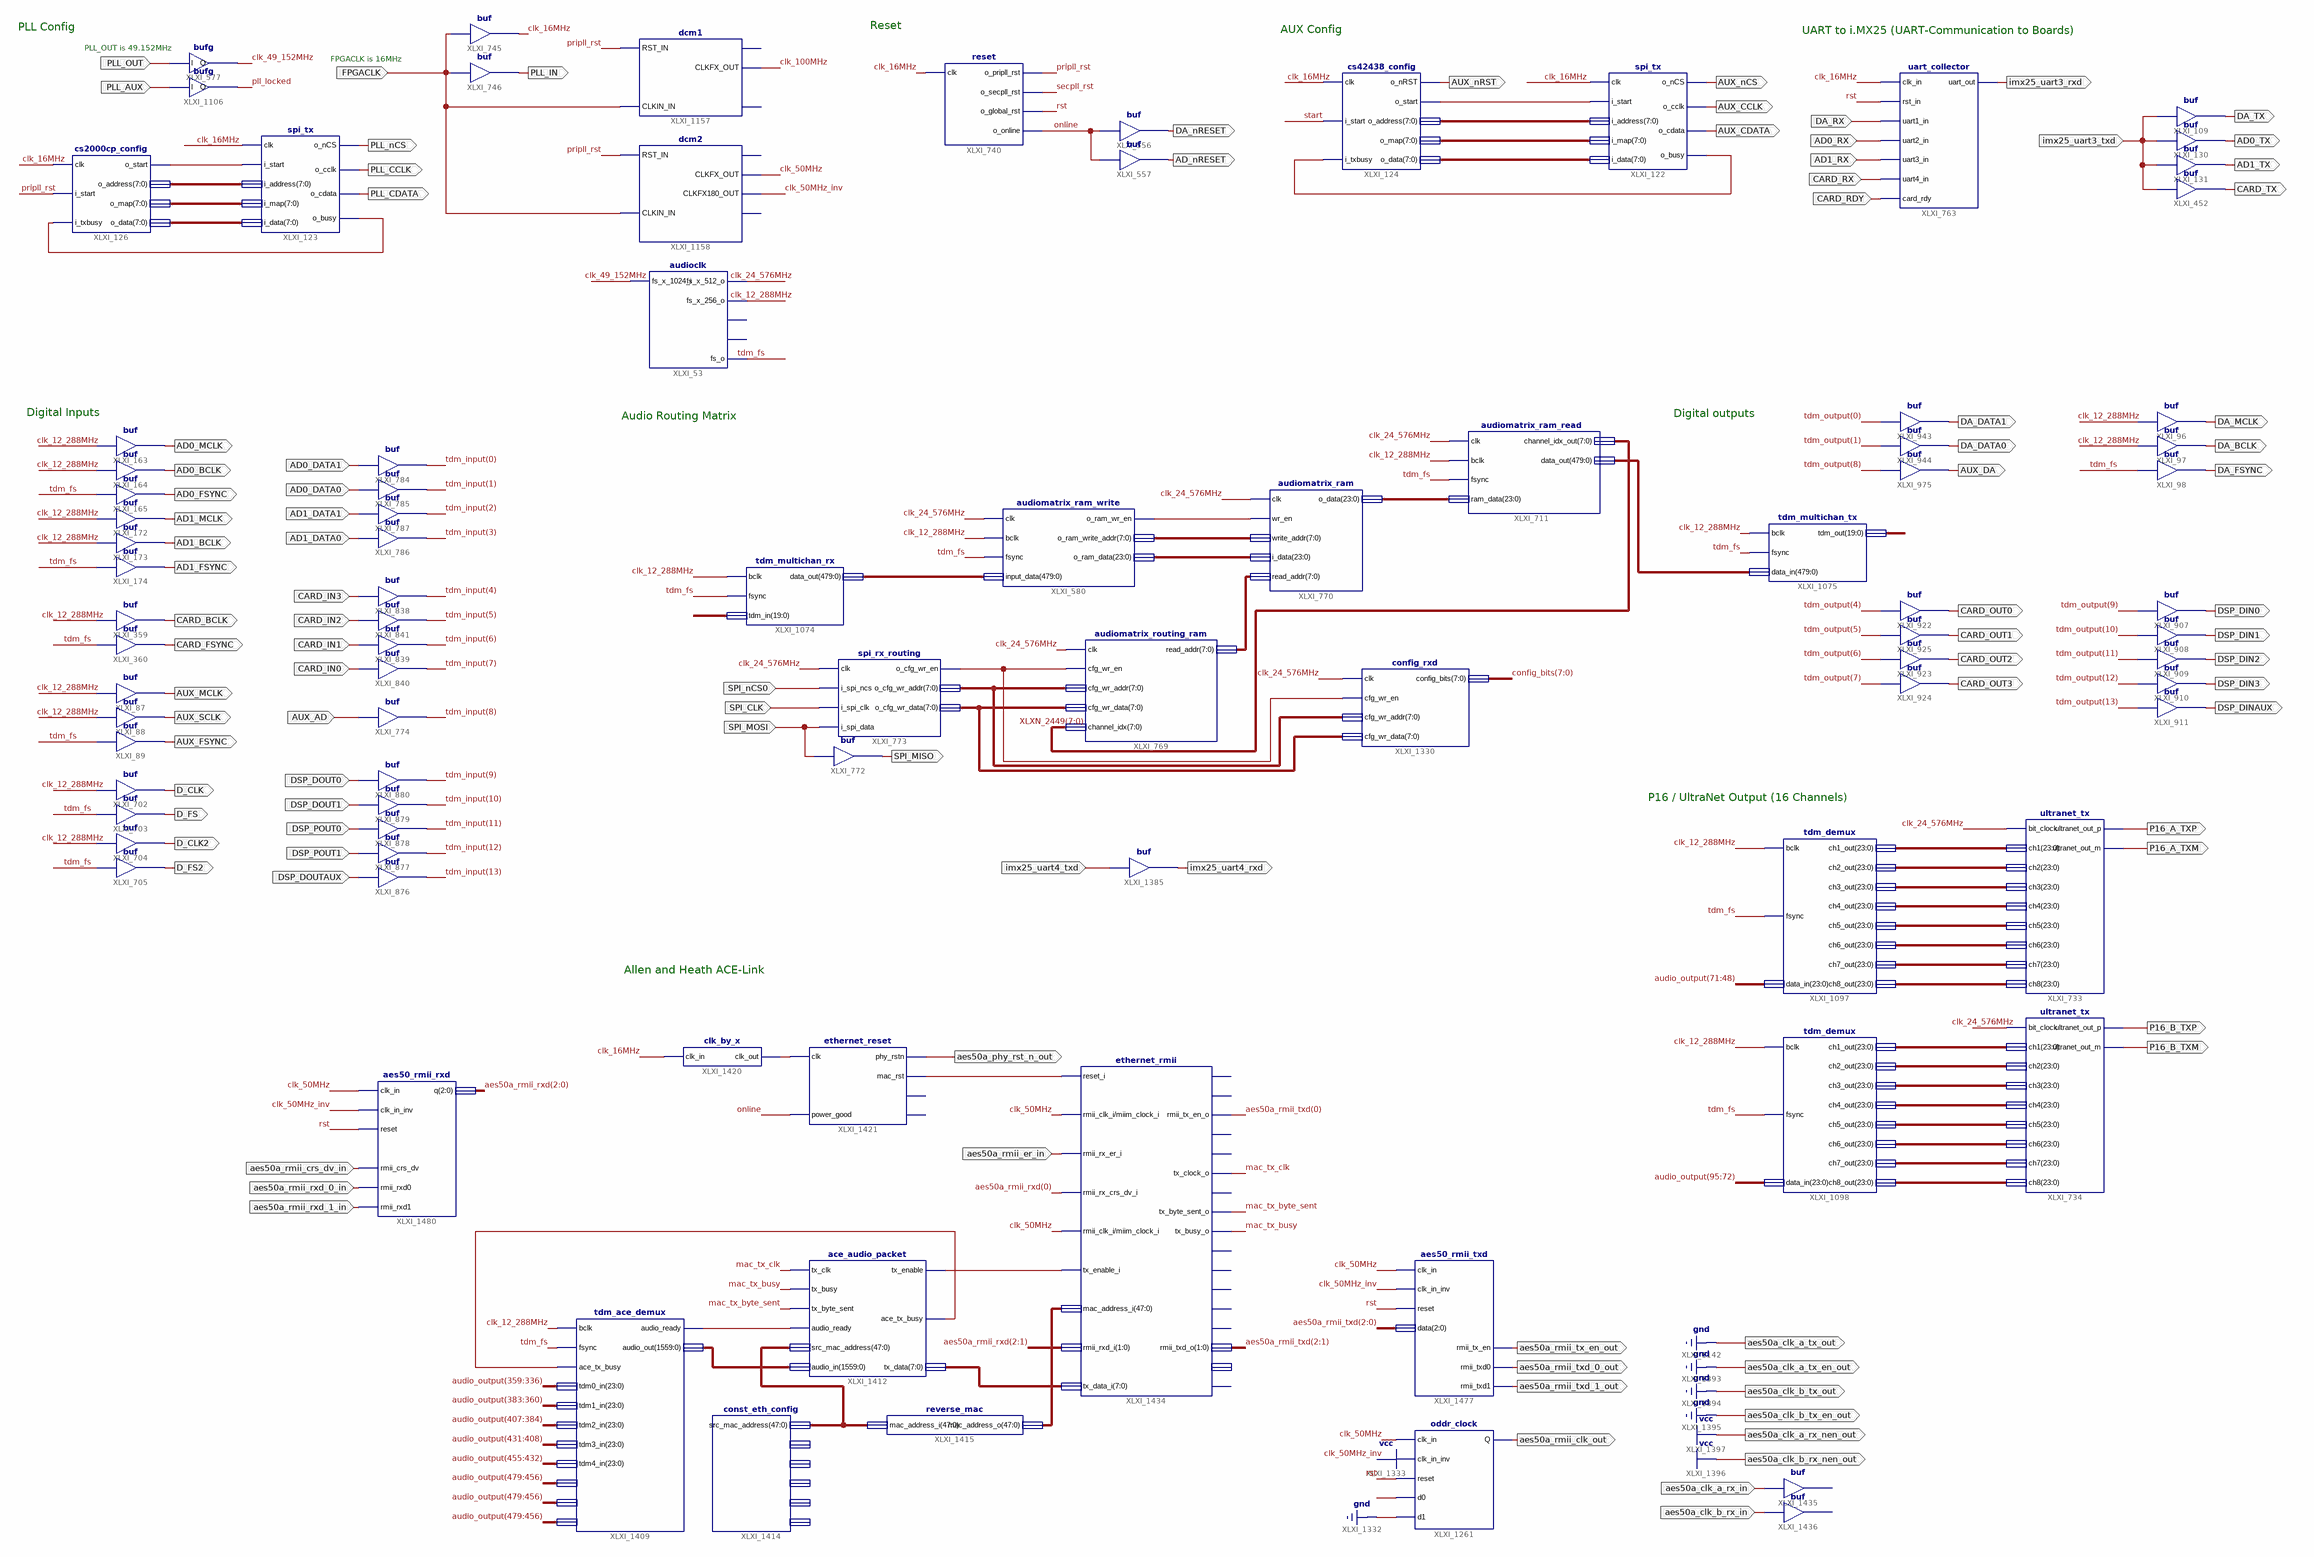
[diagram p0: schematic sheet 1]
// Xilinx ISE schematic main_withACEaudio.sch (spartan3a) as structural Verilog: 89 symbols, 95 ports
module main_withACEaudio (
  input  AD0_DATA1,
  input  AD0_DATA0,
  input  AD1_DATA1,
  input  AD1_DATA0,
  input  CARD_IN3,
  input  CARD_IN2,
  input  CARD_IN1,
  input  CARD_IN0,
  input  AUX_AD,
  input  DSP_DOUT0,
  input  DSP_DOUT1,
  input  DSP_POUT0,
  input  DSP_POUT1,
  input  DSP_DOUTAUX,
  input  SPI_MOSI,
  input  SPI_CLK,
  input  SPI_nCS0,
  input  FPGACLK,
  input  PLL_OUT,
  input  PLL_AUX,
  input  imx25_uart3_txd,
  input  CARD_RX,
  input  AD1_RX,
  input  AD0_RX,
  input  DA_RX,
  input  CARD_RDY,
  input  aes50a_rmii_er_in,
  input  imx25_uart4_txd,
  input  aes50a_clk_a_rx_in,
  input  aes50a_clk_b_rx_in,
  input  aes50a_rmii_crs_dv_in,
  input  aes50a_rmii_rxd_0_in,
  input  aes50a_rmii_rxd_1_in,
  output AD1_MCLK,
  output AD1_BCLK,
  output AD1_FSYNC,
  output AD0_MCLK,
  output AD0_BCLK,
  output AD0_FSYNC,
  output CARD_BCLK,
  output CARD_FSYNC,
  output AUX_MCLK,
  output AUX_SCLK,
  output AUX_FSYNC,
  output D_CLK2,
  output D_FS2,
  output D_CLK,
  output D_FS,
  output P16_A_TXP,
  output P16_A_TXM,
  output P16_B_TXP,
  output P16_B_TXM,
  output SPI_MISO,
  output DSP_DIN0,
  output DSP_DIN1,
  output DSP_DIN2,
  output DSP_DIN3,
  output DSP_DINAUX,
  output CARD_OUT0,
  output CARD_OUT1,
  output CARD_OUT2,
  output CARD_OUT3,
  output DA_MCLK,
  output DA_BCLK,
  output DA_FSYNC,
  output DA_DATA0,
  output DA_DATA1,
  output AUX_DA,
  output PLL_nCS,
  output PLL_CDATA,
  output PLL_CCLK,
  output PLL_IN,
  output DA_TX,
  output AD0_TX,
  output AD1_TX,
  output CARD_TX,
  output imx25_uart3_rxd,
  output AUX_nRST,
  output AUX_nCS,
  output AUX_CCLK,
  output AUX_CDATA,
  output DA_nRESET,
  output AD_nRESET,
  output aes50a_phy_rst_n_out,
  output imx25_uart4_rxd,
  output aes50a_clk_b_rx_nen_out,
  output aes50a_clk_a_rx_nen_out,
  output aes50a_clk_b_tx_en_out,
  output aes50a_clk_b_tx_out,
  output aes50a_clk_a_tx_en_out,
  output aes50a_clk_a_tx_out,
  output aes50a_rmii_clk_out,
  output aes50a_rmii_tx_en_out,
  output aes50a_rmii_txd_0_out,
  output aes50a_rmii_txd_1_out
);

  wire clk_12_288MHz, clk_16MHz, clk_24_576MHz, clk_49_152MHz, clk_50MHz, clk_50MHz_inv, clk_100MHz,
       mac_tx_busy, mac_tx_byte_sent, mac_tx_clk, online, pll_locked, pripll_rst, rst, secpll_rst, start,
       tdm_fs, XLXN_70, XLXN_222, XLXN_226, XLXN_346, XLXN_1898, XLXN_2460, XLXN_3858, XLXN_3874, XLXN_3892,
       XLXN_3930, XLXN_3936;
  wire [2:0] aes50a_rmii_rxd, aes50a_rmii_txd;
  wire [7:0] config_bits, XLXN_67, XLXN_68, XLXN_69, XLXN_223, XLXN_224, XLXN_225, XLXN_2448, XLXN_2449,
       XLXN_2997, XLXN_3661, XLXN_3662, XLXN_4092;
  wire [19:0] tdm_input, tdm_output;
  wire [23:0] XLXN_2996, XLXN_2998, XLXN_3049, XLXN_3050, XLXN_3051, XLXN_3052, XLXN_3053, XLXN_3054,
       XLXN_3055, XLXN_3056, XLXN_3057, XLXN_3058, XLXN_3059, XLXN_3060, XLXN_3061, XLXN_3062, XLXN_3063,
       XLXN_3064;
  wire [47:0] XLXN_3937, XLXN_3939;
  wire [479:0] audio_output, XLXN_2995;
  wire [1559:0] XLXN_3863;

  reset XLXI_740 (
    .clk(clk_16MHz), .o_pripll_rst(pripll_rst), .o_secpll_rst(secpll_rst), .o_global_rst(rst),
    .o_online(online));
  buf XLXI_172 (AD1_MCLK, clk_12_288MHz);
  buf XLXI_173 (AD1_BCLK, clk_12_288MHz);
  buf XLXI_174 (AD1_FSYNC, tdm_fs);
  buf XLXI_163 (AD0_MCLK, clk_12_288MHz);
  buf XLXI_164 (AD0_BCLK, clk_12_288MHz);
  buf XLXI_165 (AD0_FSYNC, tdm_fs);
  buf XLXI_784 (tdm_input[0], AD0_DATA1);
  buf XLXI_785 (tdm_input[1], AD0_DATA0);
  buf XLXI_787 (tdm_input[2], AD1_DATA1);
  buf XLXI_786 (tdm_input[3], AD1_DATA0);
  buf XLXI_838 (tdm_input[4], CARD_IN3);
  buf XLXI_841 (tdm_input[5], CARD_IN2);
  buf XLXI_839 (tdm_input[6], CARD_IN1);
  buf XLXI_840 (tdm_input[7], CARD_IN0);
  buf XLXI_359 (CARD_BCLK, clk_12_288MHz);
  buf XLXI_360 (CARD_FSYNC, tdm_fs);
  buf XLXI_87 (AUX_MCLK, clk_12_288MHz);
  buf XLXI_88 (AUX_SCLK, clk_12_288MHz);
  buf XLXI_89 (AUX_FSYNC, tdm_fs);
  buf XLXI_774 (tdm_input[8], AUX_AD);
  buf XLXI_880 (tdm_input[9], DSP_DOUT0);
  buf XLXI_879 (tdm_input[10], DSP_DOUT1);
  buf XLXI_878 (tdm_input[11], DSP_POUT0);
  buf XLXI_877 (tdm_input[12], DSP_POUT1);
  buf XLXI_876 (tdm_input[13], DSP_DOUTAUX);
  buf XLXI_704 (D_CLK2, clk_12_288MHz);
  buf XLXI_705 (D_FS2, tdm_fs);
  buf XLXI_702 (D_CLK, clk_12_288MHz);
  buf XLXI_703 (D_FS, tdm_fs);
  audiomatrix_ram_write XLXI_580 (
    .clk(clk_24_576MHz), .o_ram_wr_en(XLXN_1898), .o_ram_write_addr(XLXN_2997), .o_ram_data(XLXN_2996),
    .bclk(clk_12_288MHz), .fsync(tdm_fs), .input_data(XLXN_2995));
  audiomatrix_routing_ram XLXI_769 (
    .clk(clk_24_576MHz), .cfg_wr_en(XLXN_2460), .cfg_wr_addr(XLXN_3661), .cfg_wr_data(XLXN_3662),
    .read_addr(XLXN_2448), .channel_idx(XLXN_2449));
  audiomatrix_ram XLXI_770 (
    .clk(clk_24_576MHz), .wr_en(XLXN_1898), .o_data(XLXN_2998), .write_addr(XLXN_2997), .i_data(XLXN_2996),
    .read_addr(XLXN_2448));
  audiomatrix_ram_read XLXI_711 (
    .clk(clk_24_576MHz), .bclk(clk_12_288MHz), .fsync(tdm_fs), .ram_data(XLXN_2998),
    .channel_idx_out(XLXN_2449), .data_out(audio_output));
  tdm_multichan_rx XLXI_1074 (.bclk(clk_12_288MHz), .fsync(tdm_fs), .tdm_in(tdm_input), .data_out(XLXN_2995));
  tdm_multichan_tx XLXI_1075 (.bclk(clk_12_288MHz), .fsync(tdm_fs), .data_in(audio_output), .tdm_out(tdm_output));
  ultranet_tx XLXI_734 (
    .bit_clock(clk_24_576MHz), .ch1(XLXN_3057), .ch2(XLXN_3058), .ch3(XLXN_3059), .ch4(XLXN_3060),
    .ch5(XLXN_3061), .ch6(XLXN_3062), .ch7(XLXN_3063), .ch8(XLXN_3064), .ultranet_out_p(P16_B_TXP),
    .ultranet_out_m(P16_B_TXM));
  ultranet_tx XLXI_733 (
    .bit_clock(clk_24_576MHz), .ch1(XLXN_3049), .ch2(XLXN_3050), .ch3(XLXN_3051), .ch4(XLXN_3052),
    .ch5(XLXN_3053), .ch6(XLXN_3054), .ch7(XLXN_3055), .ch8(XLXN_3056), .ultranet_out_p(P16_A_TXP),
    .ultranet_out_m(P16_A_TXM));
  tdm_demux XLXI_1097 (
    .bclk(clk_12_288MHz), .fsync(tdm_fs), .data_in(audio_output[71:48]), .ch1_out(XLXN_3049),
    .ch2_out(XLXN_3050), .ch3_out(XLXN_3051), .ch4_out(XLXN_3052), .ch5_out(XLXN_3053), .ch6_out(XLXN_3054),
    .ch7_out(XLXN_3055), .ch8_out(XLXN_3056));
  tdm_demux XLXI_1098 (
    .bclk(clk_12_288MHz), .fsync(tdm_fs), .data_in(audio_output[95:72]), .ch1_out(XLXN_3057),
    .ch2_out(XLXN_3058), .ch3_out(XLXN_3059), .ch4_out(XLXN_3060), .ch5_out(XLXN_3061), .ch6_out(XLXN_3062),
    .ch7_out(XLXN_3063), .ch8_out(XLXN_3064));
  buf XLXI_772 (SPI_MISO, SPI_MOSI);
  spi_rx_routing XLXI_773 (
    .clk(clk_24_576MHz), .i_spi_ncs(SPI_nCS0), .i_spi_clk(SPI_CLK), .i_spi_data(SPI_MOSI),
    .o_cfg_wr_en(XLXN_2460), .o_cfg_wr_addr(XLXN_3661), .o_cfg_wr_data(XLXN_3662));
  buf XLXI_907 (DSP_DIN0, tdm_output[9]);
  buf XLXI_908 (DSP_DIN1, tdm_output[10]);
  buf XLXI_909 (DSP_DIN2, tdm_output[11]);
  buf XLXI_910 (DSP_DIN3, tdm_output[12]);
  buf XLXI_911 (DSP_DINAUX, tdm_output[13]);
  buf XLXI_922 (CARD_OUT0, tdm_output[4]);
  buf XLXI_925 (CARD_OUT1, tdm_output[5]);
  buf XLXI_923 (CARD_OUT2, tdm_output[6]);
  buf XLXI_924 (CARD_OUT3, tdm_output[7]);
  buf XLXI_96 (DA_MCLK, clk_12_288MHz);
  buf XLXI_97 (DA_BCLK, clk_12_288MHz);
  buf XLXI_98 (DA_FSYNC, tdm_fs);
  buf XLXI_944 (DA_DATA0, tdm_output[1]);
  buf XLXI_943 (DA_DATA1, tdm_output[0]);
  buf XLXI_975 (AUX_DA, tdm_output[8]);
  cs2000cp_config XLXI_126 (
    .clk(clk_16MHz), .i_start(pripll_rst), .i_txbusy(XLXN_226), .o_start(XLXN_222), .o_address(XLXN_223),
    .o_map(XLXN_224), .o_data(XLXN_225));
  spi_tx XLXI_123 (
    .clk(clk_16MHz), .i_start(XLXN_222), .i_address(XLXN_223), .i_map(XLXN_224), .i_data(XLXN_225),
    .o_nCS(PLL_nCS), .o_cclk(PLL_CCLK), .o_cdata(PLL_CDATA), .o_busy(XLXN_226));
  bufg XLXI_577 (.I(PLL_OUT), .O(clk_49_152MHz));
  bufg XLXI_1106 (.I(PLL_AUX), .O(pll_locked));
  buf XLXI_745 (clk_16MHz, FPGACLK);
  buf XLXI_746 (PLL_IN, FPGACLK);
  dcm1 XLXI_1157 (.CLKIN_IN(FPGACLK), .RST_IN(pripll_rst), .CLKFX_OUT(clk_100MHz));  // open: LOCKED_OUT, CLK0_OUT
  dcm2 XLXI_1158 (
    .CLKIN_IN(FPGACLK), .RST_IN(pripll_rst), .CLKFX_OUT(clk_50MHz), .CLKFX180_OUT(clk_50MHz_inv));  // open: LOCKED_OUT, CLK0_OUT
  audioclk XLXI_53 (
    .fs_x_1024_i(clk_49_152MHz), .fs_x_512_o(clk_24_576MHz), .fs_x_256_o(clk_12_288MHz), .fs_o(tdm_fs));  // open: fs_x_128_o, fs_x_64_o
  buf XLXI_130 (AD0_TX, imx25_uart3_txd);
  buf XLXI_131 (AD1_TX, imx25_uart3_txd);
  buf XLXI_109 (DA_TX, imx25_uart3_txd);
  buf XLXI_452 (CARD_TX, imx25_uart3_txd);
  uart_collector XLXI_763 (
    .clk_in(clk_16MHz), .rst_in(rst), .uart1_in(DA_RX), .uart2_in(AD0_RX), .uart3_in(AD1_RX),
    .uart4_in(CARD_RX), .card_rdy(CARD_RDY), .uart_out(imx25_uart3_rxd));
  spi_tx XLXI_122 (
    .clk(clk_16MHz), .i_start(XLXN_346), .i_address(XLXN_67), .i_map(XLXN_68), .i_data(XLXN_69),
    .o_nCS(AUX_nCS), .o_cclk(AUX_CCLK), .o_cdata(AUX_CDATA), .o_busy(XLXN_70));
  cs42438_config XLXI_124 (
    .clk(clk_16MHz), .i_start(start), .i_txbusy(XLXN_70), .o_nRST(AUX_nRST), .o_start(XLXN_346),
    .o_address(XLXN_67), .o_map(XLXN_68), .o_data(XLXN_69));
  config_rxd XLXI_1330 (
    .clk(clk_24_576MHz), .cfg_wr_en(XLXN_2460), .cfg_wr_addr(XLXN_3661), .cfg_wr_data(XLXN_3662),
    .config_bits(config_bits));
  buf XLXI_556 (DA_nRESET, online);
  buf XLXI_557 (AD_nRESET, online);
  ethernet_rmii XLXI_1434 (
    .reset_i(XLXN_3930), .rmii_clk_i(clk_50MHz), .rmii_rx_er_i(aes50a_rmii_er_in),
    .rmii_rx_crs_dv_i(aes50a_rmii_rxd[0]), .miim_clock_i(clk_50MHz), .tx_enable_i(XLXN_3936),
    .mac_address_i(XLXN_3937), .rmii_rxd_i(aes50a_rmii_rxd[2:1]), .tx_data_i(XLXN_4092),
    .rmii_tx_en_o(aes50a_rmii_txd[0]), .tx_clock_o(mac_tx_clk), .tx_byte_sent_o(mac_tx_byte_sent),
    .tx_busy_o(mac_tx_busy), .rmii_txd_o(aes50a_rmii_txd[2:1]));  // open: mdio_io, reset_o, rmii_tx_er_o, mdc_o, link_up_o, tx_reset_o, rx_clock_o, rx_reset_o, rx_frame_o, rx_byte_received_o, rx_error_o, rx_data_o
  clk_by_x XLXI_1420 (.clk_in(clk_16MHz), .clk_out(XLXN_3874));
  ethernet_reset XLXI_1421 (
    .clk(XLXN_3874), .power_good(online), .phy_rstn(aes50a_phy_rst_n_out), .mac_rst(XLXN_3930));  // open: sendArpRequest, tx_online
  tdm_ace_demux XLXI_1409 (
    .bclk(clk_12_288MHz), .fsync(tdm_fs), .ace_tx_busy(XLXN_3892), .tdm0_in(audio_output[359:336]),
    .tdm1_in(audio_output[383:360]), .tdm2_in(audio_output[407:384]), .tdm3_in(audio_output[431:408]),
    .tdm4_in(audio_output[455:432]), .tdm5_in(audio_output[479:456]), .tdm6_in(audio_output[479:456]),
    .tdm7_in(audio_output[479:456]), .audio_ready(XLXN_3858), .audio_out(XLXN_3863));
  ace_audio_packet XLXI_1412 (
    .tx_clk(mac_tx_clk), .tx_busy(mac_tx_busy), .tx_byte_sent(mac_tx_byte_sent), .audio_ready(XLXN_3858),
    .src_mac_address(XLXN_3939), .audio_in(XLXN_3863), .tx_enable(XLXN_3936), .ace_tx_busy(XLXN_3892),
    .tx_data(XLXN_4092));
  const_eth_config XLXI_1414 (.src_mac_address(XLXN_3939));  // open: src_ip_address, dst_mac_address, dst_ip_address, src_udp_port, dst_udp_port
  reverse_mac XLXI_1415 (.mac_address_i(XLXN_3939), .mac_address_o(XLXN_3937));
  buf XLXI_1385 (imx25_uart4_rxd, imx25_uart4_txd);
  // buf XLXI_1435 has open pins: I=aes50a_clk_a_rx_in, O=open
  // buf XLXI_1436 has open pins: I=aes50a_clk_b_rx_in, O=open
  oddr_clock XLXI_1261 (
    .clk_in(clk_50MHz), .clk_in_inv(clk_50MHz_inv), .reset(rst), .d0(1'b1), .d1(1'b0), .Q(aes50a_rmii_clk_out));
  aes50_rmii_txd XLXI_1477 (
    .clk_in(clk_50MHz), .clk_in_inv(clk_50MHz_inv), .reset(rst), .data(aes50a_rmii_txd),
    .rmii_tx_en(aes50a_rmii_tx_en_out), .rmii_txd0(aes50a_rmii_txd_0_out), .rmii_txd1(aes50a_rmii_txd_1_out));
  aes50_rmii_rxd XLXI_1480 (
    .clk_in(clk_50MHz), .clk_in_inv(clk_50MHz_inv), .reset(rst), .q(aes50a_rmii_rxd),
    .rmii_crs_dv(aes50a_rmii_crs_dv_in), .rmii_rxd0(aes50a_rmii_rxd_0_in), .rmii_rxd1(aes50a_rmii_rxd_1_in));

  assign aes50a_clk_a_rx_nen_out = 1'b1;
  assign aes50a_clk_a_tx_en_out = 1'b0;
  assign aes50a_clk_a_tx_out = 1'b0;
  assign aes50a_clk_b_rx_nen_out = 1'b1;
  assign aes50a_clk_b_tx_en_out = 1'b0;
  assign aes50a_clk_b_tx_out = 1'b0;

  // Notes on the sheet:
  //   Reset
  //   PLL Config
  //   AUX Config
  //   UART to i.MX25 (UART-Communication to Boards)
  //   PLL_OUT is 49.152MHz
  //   FPGACLK is 16MHz
  //   Digital Inputs
  //   Digital outputs
  //   Audio Routing Matrix
  //   P16 / UltraNet Output (16 Channels)
  //   Allen and Heath ACE-Link
endmodule
